# EAGLE schematic NFET_NPN (EAGLE 6.5.0)
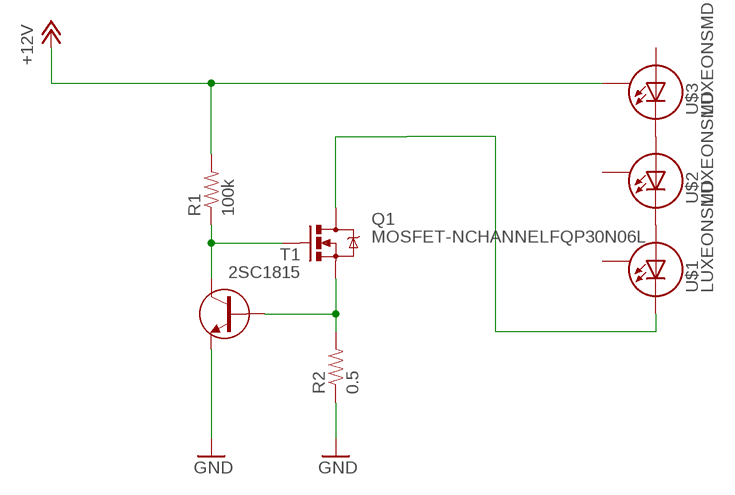
[diagram p0: schematic, sheet 1]

## Parts
Q1  MOSFET-NCHANNELFQP30N06L  [TO220V]
R1  100k  RESISTORPTH-1/4W  [AXIAL-0.4]
R2  0.5  RESISTORPTH-1/4W  [AXIAL-0.4]
T1  2SC1815  [TO92-ECB]
U$1  LUXEONSMD  [LUXEON]
U$2  LUXEONSMD  [LUXEON]
U$3  LUXEONSMD  [LUXEON]

## Nets
+12V: R1.P$2 U$3.S
GND: R2.P$1 T1.1(E)
N$2: Q1.1(G) R1.P$1 T1.2(C)
N$3: Q1.3(S) R2.P$2 T1.3(B)
N$6: Q1.2(D) U$1.C
N$7: U$2.A U$3.C
N$8: U$1.A U$2.C
Unconnected: U$1.S U$2.S U$3.A

## Library data of the parts
Q1 = SparkFun-DiscreteSemi:MOSFET-NCHANNEL: Common NMOSFET Parts MFG P/N Store ID Prod ID FDD8780 TRANS-09984 SI7820DN TRANS-11055 FDS6630A IC-08089 2N7002PW TRANS-11151 FQP30N06L COM-10213 TRANS-10060 BSS123LT1G TRANS-08345 BSS138 TRANS-00830 BS170 2N7000; PROD_ID: TRANS-10060
R1 R2 = My Library:RESISTOR: Resistor Basic schematic elements and footprints for 0603, 1206, and PTH resistors.
T1 = My Library:2SC*: NPN TRANSISTOR Big oval pads
U$1-U$3 = SparkFun:LUXEON: Luxeon LED This footprint works with the current 1 Watt, 3 Watt, and 5 Watt LEDs. These blindingly bright LEDs generate a lot of heat so the footprint has a large pad under the LED for thermal transfer. Schematic and footprint are proven. Spark Fun Electronics SKU : COM-00603